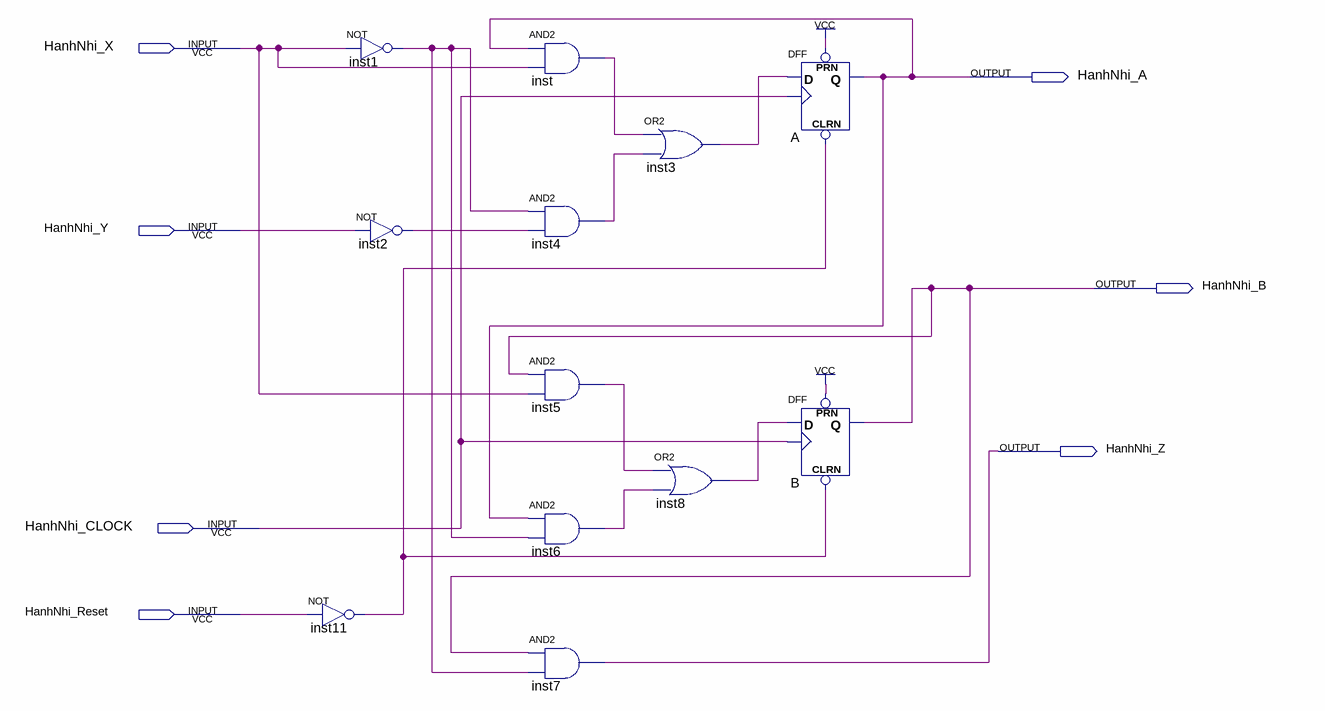
[diagram p0: schematic sheet]
// Quartus schematic Assignment3.bdf as structural Verilog: 12 symbols, 7 pins
module Assignment3 (
  input  HanhNhi_X,
  input  HanhNhi_Y,
  input  HanhNhi_CLOCK,
  input  HanhNhi_Reset,
  output HanhNhi_A,
  output HanhNhi_B,
  output HanhNhi_Z
);

  wire inst1_out, inst2_out, inst3_out, inst4_out, inst5_out, inst6_out, inst8_out, inst11_out, inst_out;

  not inst11 (inst11_out, HanhNhi_Reset);
  not inst1 (inst1_out, HanhNhi_X);
  not inst2 (inst2_out, HanhNhi_Y);
  and inst (inst_out, HanhNhi_A, HanhNhi_X);
  and inst4 (inst4_out, inst1_out, inst2_out);
  and inst5 (inst5_out, HanhNhi_B, HanhNhi_X);
  and inst6 (inst6_out, HanhNhi_A, inst1_out);
  and inst7 (HanhNhi_Z, HanhNhi_B, inst1_out);
  or inst3 (inst3_out, inst_out, inst4_out);
  or inst8 (inst8_out, inst5_out, inst6_out);
  DFF A (.CLRN(inst11_out), .CLK(HanhNhi_CLOCK), .D(inst3_out), .PRN(1'b1), .Q(HanhNhi_A));
  DFF B (.CLRN(inst11_out), .CLK(HanhNhi_CLOCK), .D(inst8_out), .PRN(1'b1), .Q(HanhNhi_B));
endmodule
